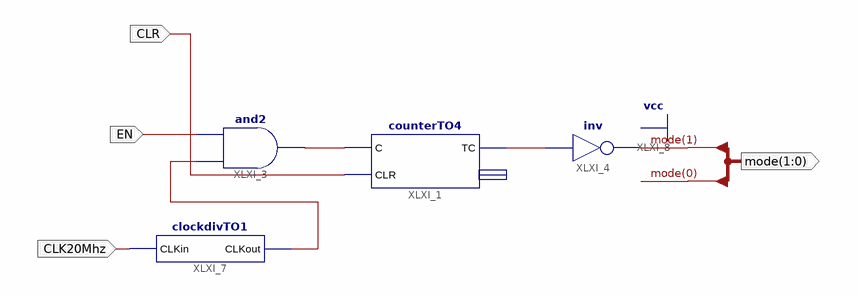
[diagram p0: schematic sheet 1]
// Xilinx ISE schematic INCORRECT.sch (spartan6) as structural Verilog: 4 symbols, 4 ports
module INCORRECT (
  input  EN,
  input  CLK20Mhz,
  input  CLR,
  output [1:0] mode
);

  wire XLXN_3, XLXN_11, XLXN_12;

  counterTO4 XLXI_1 (.C(XLXN_3), .CLR(CLR), .TC(XLXN_12));  // open: Q
  and XLXI_3 (XLXN_3, XLXN_11, EN);
  clockdivTO1 XLXI_7 (.CLKin(CLK20Mhz), .CLKout(XLXN_11));
  not XLXI_4 (mode[1], XLXN_12);

  assign mode[0] = 1'b1;
endmodule
